# Altium schematic sheet DRV8711_MSP430.SchDoc
size B
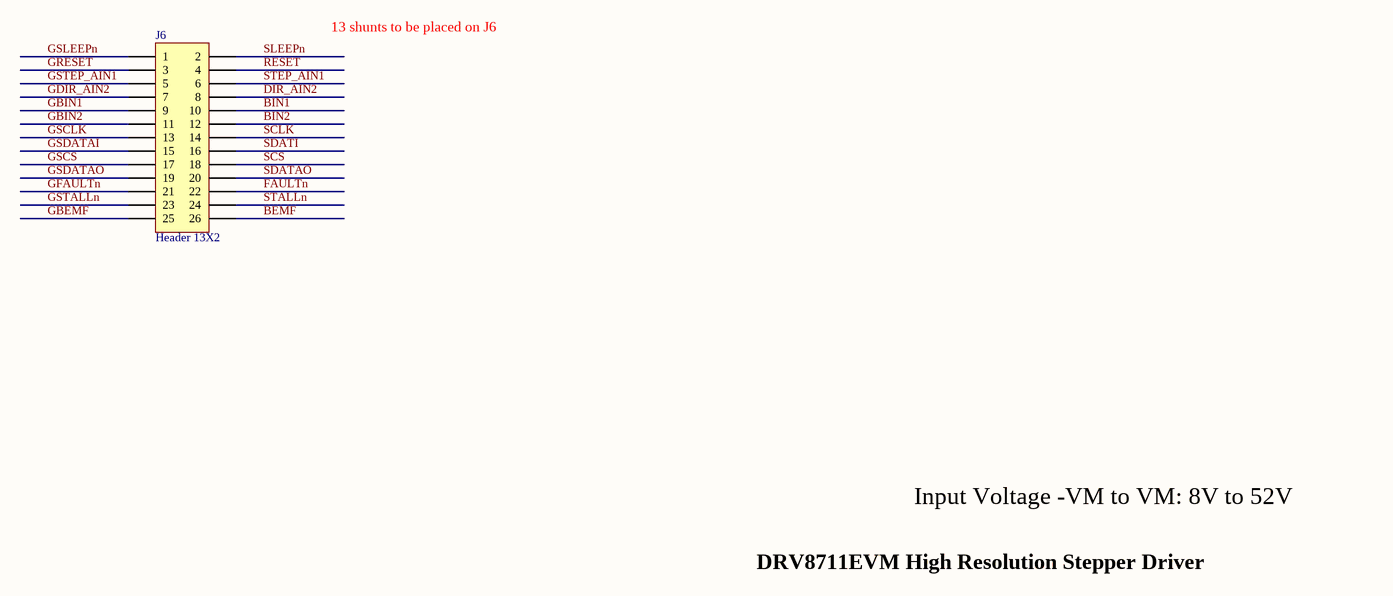
[diagram p0: DRV8711_MSP430.SchDoc]

## Parts
J6  Header 13X2  [HDR2X13]

## Nets
BEMF: J6.26
BIN1: J6.10
BIN2: J6.12
DIR_AIN2: J6.8
FAULTn: J6.22
GBEMF: J6.25
GBIN1: J6.9
GBIN2: J6.11
GDIR_AIN2: J6.7
GFAULTn: J6.21
GRESET: J6.3
GSCLK: J6.13
GSCS: J6.17
GSDATAI: J6.15
GSDATAO: J6.19
GSLEEPn: J6.1
GSTALLn: J6.23
GSTEP_AIN1: J6.5
RESET: J6.4
SCLK: J6.14
SCS: J6.18
SDATAO: J6.20
SDATI: J6.16
SLEEPn: J6.2
STALLn: J6.24
STEP_AIN1: J6.6

## Notes on the sheet
- 13 shunts to be placed on J6
- Input Voltage -VM to VM: 8V to 52V
- DRV8711EVM High Resolution Stepper Driver

## Library data of the parts
J6 = Header 13X2: CONN HEADER .100 DUAL STR 26POS; DK Part Number: 929665-09-13-ND; Manufacturer: 3M; MFG Part Number: 929665-09-13-I; Value: 26 Pos Header